# EAGLE design plcc44-adapter (EAGLE 6.1)
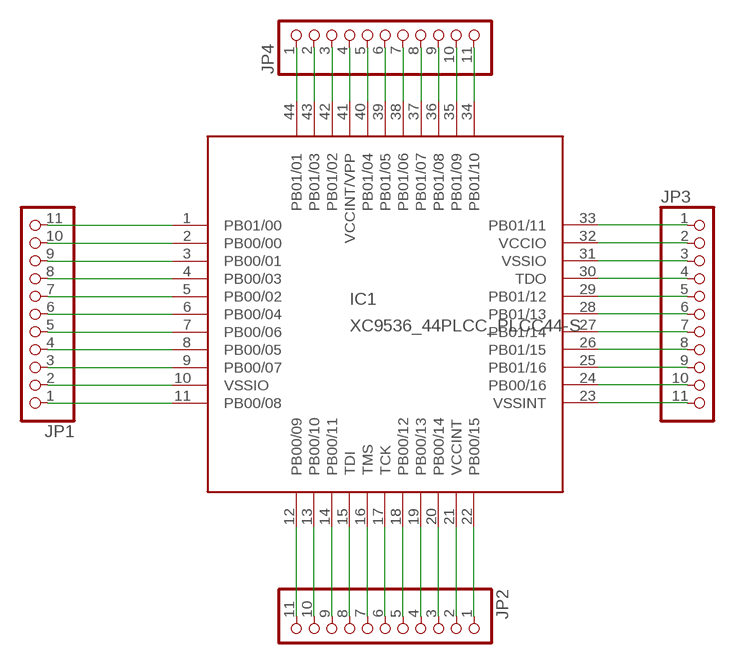
[diagram p0: schematic, sheet 1]

## Parts
IC1  XC9536_44PLCC_PLCC44-S  [PLCC-S44]
JP1  PINHD-1X11  [1X11]
JP2  PINHD-1X11  [1X11]
JP3  PINHD-1X11  [1X11]
JP4  PINHD-1X11  [1X11]

## Nets
N$1: IC1.11(PB00/08) JP1.1
N$2: IC1.10(VSSIO) JP1.2
N$3: IC1.9(PB00/07) JP1.3
N$4: IC1.8(PB00/05) JP1.4
N$5: IC1.7(PB00/06) JP1.5
N$6: IC1.6(PB00/04) JP1.6
N$7: IC1.5(PB00/02) JP1.7
N$8: IC1.4(PB00/03) JP1.8
N$9: IC1.3(PB00/01) JP1.9
N$10: IC1.2(PB00/00) JP1.10
N$11: IC1.1(PB01/00) JP1.11
N$12: IC1.22(PB00/15) JP2.1
N$13: IC1.21(VCCINT) JP2.2
N$14: IC1.20(PB00/14) JP2.3
N$15: IC1.19(PB00/13) JP2.4
N$16: IC1.18(PB00/12) JP2.5
N$17: IC1.17(TCK) JP2.6
N$18: IC1.16(TMS) JP2.7
N$19: IC1.15(TDI) JP2.8
N$20: IC1.14(PB00/11) JP2.9
N$21: IC1.13(PB00/10) JP2.10
N$22: IC1.12(PB00/09) JP2.11
N$23: IC1.33(PB01/11) JP3.1
N$24: IC1.32(VCCIO) JP3.2
N$25: IC1.31(VSSIO) JP3.3
N$26: IC1.30(TDO) JP3.4
N$27: IC1.29(PB01/12) JP3.5
N$28: IC1.28(PB01/13) JP3.6
N$29: IC1.27(PB01/14) JP3.7
N$30: IC1.26(PB01/15) JP3.8
N$31: IC1.25(PB01/16) JP3.9
N$32: IC1.24(PB00/16) JP3.10
N$33: IC1.23(VSSINT) JP3.11
N$34: IC1.44(PB01/01) JP4.1
N$35: IC1.43(PB01/03) JP4.2
N$36: IC1.42(PB01/02) JP4.3
N$37: IC1.41(VCCINT/VPP) JP4.4
N$38: IC1.40(PB01/04) JP4.5
N$39: IC1.39(PB01/05) JP4.6
N$40: IC1.38(PB01/06) JP4.7
N$41: IC1.37(PB01/07) JP4.8
N$42: IC1.36(PB01/08) JP4.9
N$43: IC1.35(PB01/09) JP4.10
N$44: IC1.34(PB01/10) JP4.11

## Library data of the parts
IC1 = _MY_OWN_LIB:XC9536_44PLCC: xc9536_pc44 XC9500 In-System Programmable CPLD Family Auto generated by make-symbol-device-package-bsdl.ulp Rev. 34 Source: xc9536_pc44.bsd
JP1-JP4 = pinhead:PINHD-1X11: PIN HEADER

## Board
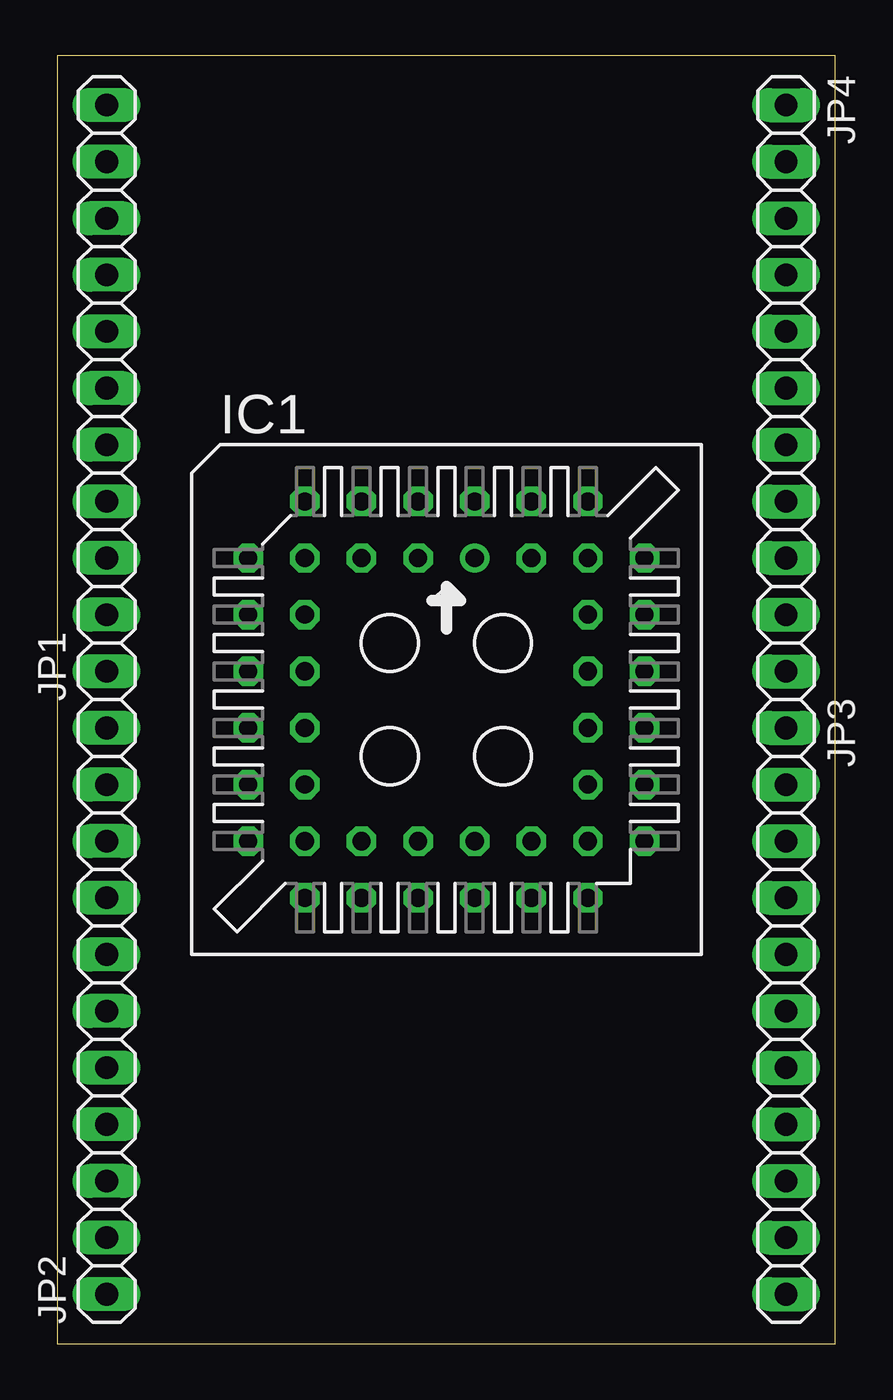
[diagram p1: board, top side]
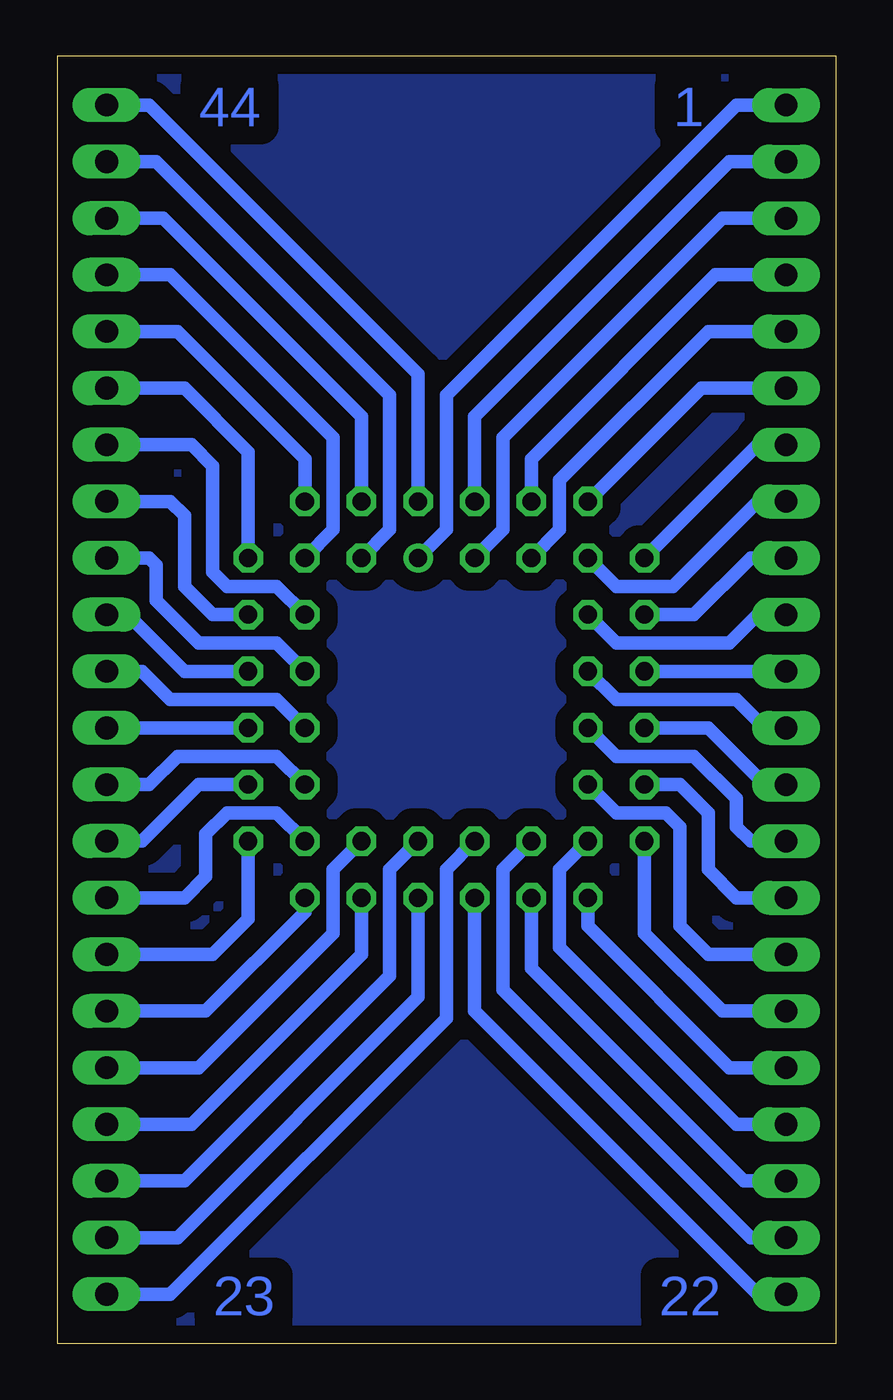
[diagram p2: board, bottom side, seen from below]

Size 34.91 x 57.77 mm. Coordinates in mm from the lower left corner, seen from the top.
Outline: 0,0 34.91,0 34.91,57.77 0,57.77 0,0
Copper layers (1*16): Top 0.035mm / dielectric 1.5mm / Bottom 0.035mm
Design rules: minimum track width 10mil, minimum drill 24mil, track to track 12mil, track to pad 12mil, pad to pad 12mil, via to via 12mil, smd to smd 10mil, copper to edge 12mil, drill to drill 12mil, minimum pad ring 10mil, minimum via ring 10mil, stop-mask expansion 4mil, vias tented up to drill 0mil, thermal gap 12mil

### Footprints (pad centres in the part's own frame; a part is rotated, then mirrored left to right if it is on the bottom)
PLCC-S44 = drill 0.813: 1 1.27,6.35 | drill 0.813 octagon: 2 -1.27,8.89; 3 -1.27,6.35; 4 -3.81,8.89; 5 -3.81,6.35; 6 -6.35,8.89; 7 -8.89,6.35; 8 -6.35,6.35; 9 -8.89,3.81; 10 -6.35,3.81; 11 -8.89,1.27; 12 -6.35,1.27; 13 -8.89,-1.27; 14 -6.35,-1.27; 15 -8.89,-3.81; 16 -6.35,-3.81; 17 -8.89,-6.35; 18 -6.35,-8.89; 19 -6.35,-6.35; 20 -3.81,-8.89; 21 -3.81,-6.35; 22 -1.27,-8.89; 23 -1.27,-6.35; 24 1.27,-8.89; 25 1.27,-6.35; 26 3.81,-8.89; 27 3.81,-6.35; 28 6.35,-8.89; 29 8.89,-6.35; 30 6.35,-6.35; 31 8.89,-3.81; 32 6.35,-3.81; 33 8.89,-1.27; 34 6.35,-1.27; 35 8.89,1.27; 36 6.35,1.27; 37 8.89,3.81; 38 6.35,3.81; 39 8.89,6.35; 40 6.35,8.89; 41 6.35,6.35; 42 3.81,8.89; 43 3.81,6.35; 44 1.27,8.89
1X11 = drill 1.016 long: 1 -12.7,0; 2 -10.16,0; 3 -7.62,0; 4 -5.08,0; 5 -2.54,0; 6 0,0; 7 2.54,0; 8 5.08,0; 9 7.62,0; 10 10.16,0; 11 12.7,0

### Placement (x,y rotation side)
IC1  17.46,28.89 0 top
JP1  2.22,42.86 90 top
JP2  2.22,14.92 90 top
JP3  32.7,14.92 270 top
JP4  32.7,42.86 270 top

### Tracks (layer width: path | path; a pad name or v marks a point on that pad's centre or on a via)
N$1
  Bottom 0.61: IC1.11 JP1.1
N$2
  Bottom 0.61: IC1.10 9.84,31.43 4.76,31.43 3.49,32.7 JP1.2
N$3
  Bottom 0.61: IC1.9 6.35,32.7 3.81,35.24 JP1.3
N$4
  Bottom 0.61: IC1.8 9.84,33.97 7.3,33.97 3.49,37.78 JP1.4
N$5
  Bottom 0.61: IC1.7 3.49,40.32 JP1.5
N$6
  Bottom 0.61: JP1.6 6.03,42.86 IC1.6
N$7
  Bottom 0.61: IC1.5 12.38,36.51 12.38,38.73 5.71,45.4 JP1.7
N$8
  Bottom 0.61: JP1.8 5.4,47.94 13.65,39.69 IC1.4
N$9
  Bottom 0.61: IC1.3 14.92,36.51 14.92,40.64 5.08,50.48 JP1.9
N$10
  Bottom 0.61: JP1.10 4.76,53.02 16.19,41.59 IC1.2
N$11
  Bottom 0.61: IC1.1 17.46,36.51 17.46,42.55 4.45,55.56 JP1.11
N$12
  Bottom 0.61: JP2.1 3.49,2.22 16.19,14.92 IC1.22
N$13
  Bottom 0.61: IC1.21 14.92,21.27 14.92,15.88 3.81,4.76 JP2.2
N$14
  Bottom 0.61: JP2.3 4.13,7.3 13.65,16.83 IC1.20
N$15
  Bottom 0.61: IC1.19 12.38,21.27 12.38,17.78 4.45,9.84 JP2.4
N$16
  Bottom 0.61: JP2.5 4.76,12.38 11.11,18.73 IC1.18
N$17
  Bottom 0.61: JP2.6 5.08,14.92 8.57,18.41 IC1.17
N$18
  Bottom 0.61: IC1.16 9.84,23.81 7.62,23.81 6.99,23.18 6.99,18.73 5.71,17.46 JP2.7
N$19
  Bottom 0.61: IC1.15 6.99,25.08 5.71,23.81 5.71,21.27 4.45,20 JP2.8
N$20
  Bottom 0.61: IC1.14 9.84,26.35 6.35,26.35 4.45,24.45 4.45,23.18 3.81,22.54 JP2.9
N$21
  Bottom 0.61: IC1.13 5.71,27.62 3.17,25.08 JP2.10
N$22
  Bottom 0.61: IC1.12 9.84,28.89 4.45,28.89 3.17,27.62 JP2.11
N$23
  Bottom 0.61: IC1.33 JP3.1
N$24
  Bottom 0.61: IC1.32 25.08,26.35 29.53,26.35 30.8,25.08 JP3.2
N$25
  Bottom 0.61: IC1.31 28.57,25.08 31.11,22.54 JP3.3
N$26
  Bottom 0.61: IC1.30 25.08,23.81 27.3,23.81 28.26,22.86 28.26,20.95 29.21,20 JP3.4
N$27
  Bottom 0.61: IC1.29 26.35,19.05 27.94,17.46 JP3.5
N$28
  Bottom 0.61: JP3.6 28.26,14.92 23.81,19.37 IC1.28
N$29
  Bottom 0.61: IC1.27 22.54,21.27 22.54,18.41 28.57,12.38 JP3.7
N$30
  Bottom 0.61: JP3.8 28.89,9.84 21.27,17.46 IC1.26
N$31
  Bottom 0.61: IC1.25 20,21.27 20,16.51 29.21,7.3 JP3.9
N$32
  Bottom 0.61: JP3.10 29.53,4.76 18.73,15.56 IC1.24
N$33
  Bottom 0.61: IC1.23 17.46,21.27 17.46,14.61 29.84,2.22 JP3.11
N$34
  Bottom 0.61: JP4.1 30.8,55.56 18.73,43.5 IC1.44
N$35
  Bottom 0.61: IC1.43 20,36.51 20,42.55 30.48,53.02 JP4.2
N$36
  Bottom 0.61: JP4.3 30.16,50.48 21.27,41.59 IC1.42
N$37
  Bottom 0.61: IC1.41 22.54,36.51 22.54,40.64 29.84,47.94 JP4.4
N$38
  Bottom 0.61: JP4.5 29.53,45.4 23.81,39.69 IC1.40
N$39
  Bottom 0.61: JP4.6 29.21,42.86 26.35,40.01 IC1.39
N$40
  Bottom 0.61: IC1.38 25.08,33.97 27.3,33.97 27.94,34.61 27.94,39.37 28.89,40.32 JP4.7
N$41
  Bottom 0.61: IC1.37 27.94,32.7 29.21,33.97 29.21,37.15 29.84,37.78 JP4.8
N$42
  Bottom 0.61: IC1.36 25.08,31.43 28.57,31.43 30.48,33.34 30.48,34.92 30.8,35.24 JP4.9
N$43
  Bottom 0.61: IC1.35 29.21,30.16 31.75,32.7 JP4.10
N$44
  Bottom 0.61: IC1.34 25.08,28.89 29.84,28.89 31.11,30.16 JP4.11
N$45
  pour Bottom (isolate 0.813): 0,0 34.92,0 34.92,57.78 0,57.78

### Text on the board
Bottom: 1 | 44 | 22 | 23